# EAGLE design apex-iii-core (EAGLE 6.0)
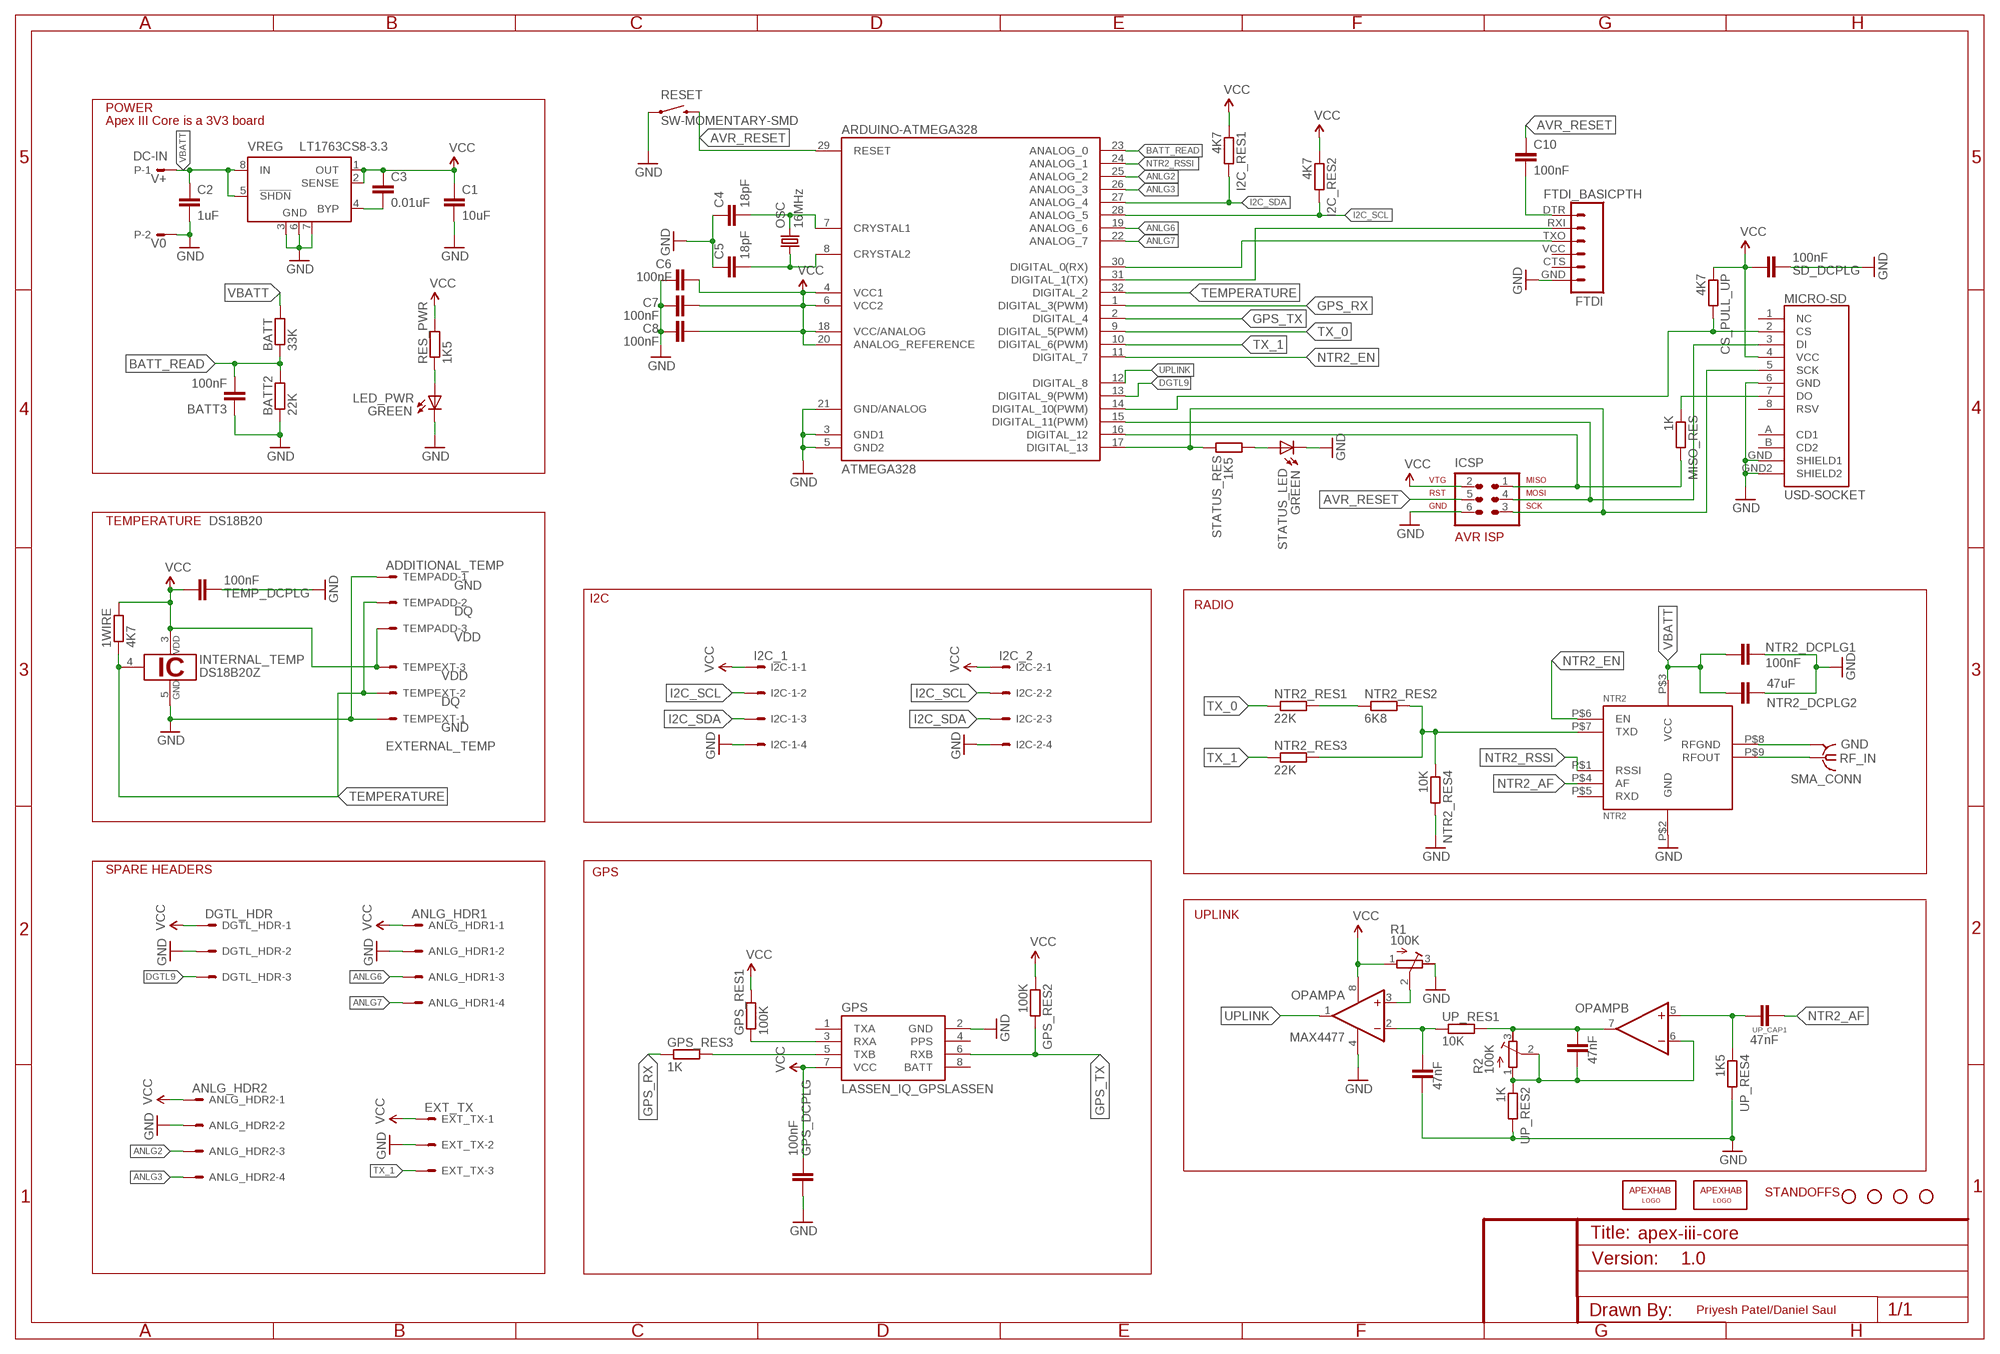
[diagram p0: schematic, sheet 1]

## Parts
1WIRE  4K7  R-EU_R0805  [R0805]
ANLG_HDR1  ANLG_HDR1  22-27-2041-04  [6410-04]
ANLG_HDR2  ANLG_HDR2  22-27-2041-04  [6410-04]
ARDUINO-ATMEGA328  ATMEGA328  ATMEGA168-AU  [TQFP32-08]
BATT  33K  R-EU_R0805  [R0805]
BATT2  22K  R-EU_R0805  [R0805]
BATT3  100nF  CAP0805  [0805]
C1  10uF  CAP0805  [0805]
C2  1uF  CAP0805  [0805]
C3  0.01uF  CAP0805  [0805]
C4  18pF  CAP0805  [0805]
C5  18pF  CAP0805  [0805]
C6  100nF  CAP0805  [0805]
C7  100nF  CAP0805  [0805]
C8  100nF  CAP0805  [0805]
C10  100nF  CAP0805  [0805]
CS_PULL_UP  4K7  R-EU_R0805  [R0805]
DGTL_HDR  DGTL_HDR  22-27-2031-03  [6410-03]
EXT_TX  EXT_TX  22-27-2031-03  [6410-03]
FTDI  FTDI_BASICPTH  [FTDI_BASIC]
GPS  LASSEN_IQ_GPSLASSEN  [LASSEN_IQ_GPS]
GPS_DCPLG  100nF  CAP0805  [0805]
GPS_RES1  100K  R-EU_R0805  [R0805]
GPS_RES2  100K  R-EU_R0805  [R0805]
GPS_RES3  1K  R-EU_R0805  [R0805]
I2C-1  I2C_1  22-27-2041-04  [6410-04]
I2C-2  I2C_2  22-27-2041-04  [6410-04]
I2C_RES1  4K7  R-EU_R0805  [R0805]
I2C_RES2  4K7  R-EU_R0805  [R0805]
ICSP  AVR-ISP-6  [AVR-ISP-6]
INTERNAL_TEMP  DS18B20Z  [SO08]
JP1  STAND-OFF  [STAND-OFF]
JP2  STAND-OFF  [STAND-OFF]
JP3  STAND-OFF  [STAND-OFF]
JP4  STAND-OFF  [STAND-OFF]
JP5  APEXHAB-LOGO_APEXHAB-SMALL  [APEXHAB-LOGO-SMALL]
JP6  APEXHAB-LOGO_APEXHAB  [APEXHAB-LOGO]
LED_PWR  GREEN  LEDCHIPLED_0603  [CHIPLED_0603]
MICRO-SD  USD-SOCKET  [MICRO-SD-PUSH-PULL]
MISO_RES  1K  R-EU_R0805  [R0805]
NTR2  NTR2  [NTR2]
NTR2_DCPLG1  100nF  CAP0805  [0805]
NTR2_DCPLG2  47uF  CAP0805  [0805]
NTR2_RES1  22K  R-EU_R0805  [R0805]
NTR2_RES2  6K8  R-EU_R0805  [R0805]
NTR2_RES3  22K  R-EU_R0805  [R0805]
NTR2_RES4  10K  R-EU_R0805  [R0805]
OPAMP  MAX4477  CA3240ED  [SO08]
OSC  16MHz  CRYSTAL5X3  [CRYSTAL-SMD-5X3]
P  DC-IN  22-27-2021-02  [6410-02]
R1  100K  R-TRIMM3214W  [RTRIM3214W]
R2  100K  R-TRIMM3214W  [RTRIM3214W]
RES_PWR  1K5  R-EU_R0805  [R0805]
RESET  SW-MOMENTARY-SMD  SWITCH-MOMENTARY-2-SMD-1101NE  [TACTILE-SWITCH-1101NE]
SD_DCPLG  100nF  CAP0805  [0805]
SMA_CONN  SMA-142-0701-801/806  [J502-ND-142-0701-801/806]
STATUS_LED  GREEN  LEDCHIPLED_0603  [CHIPLED_0603]
STATUS_RES  1K5  R-EU_R0805  [R0805]
TEMP_DCPLG  100nF  CAP0805  [0805]
TEMPADD  ADDITIONAL_TEMP  22-27-2031-03  [6410-03]
TEMPEXT  EXTERNAL_TEMP  22-27-2031-03  [6410-03]
UP_CAP1  47nF  CAP0805  [0805]
UP_CAP3  47nF  CAP0805  [0805]
UP_CAP4  47nF  CAP0805  [0805]
UP_RES1  10K  R-EU_R0805  [R0805]
UP_RES2  1K  R-EU_R0805  [R0805]
UP_RES4  1K5  R-EU_R0805  [R0805]
VREG  LT1763CS8-3.3  [SOIC8]

## Nets
ANLG2: ANLG_HDR2.3 ARDUINO-ATMEGA328.25(ANALOG_2)
ANLG3: ANLG_HDR2.4 ARDUINO-ATMEGA328.26(ANALOG_3)
ANLG6: ANLG_HDR1.3 ARDUINO-ATMEGA328.19(ANALOG_6)
ANLG7: ANLG_HDR1.4 ARDUINO-ATMEGA328.22(ANALOG_7)
AVR_RESET: ARDUINO-ATMEGA328.29(RESET) C10.1 ICSP.5 RESET.P$2
BATT_READ: ARDUINO-ATMEGA328.23(ANALOG_0) BATT2.2 BATT3.2 BATT.1
DGTL9: ARDUINO-ATMEGA328.13(DIGITAL_9(PWM)) DGTL_HDR.3
GND: ANLG_HDR1.2 ANLG_HDR2.2 ARDUINO-ATMEGA328.3(GND1) ARDUINO-ATMEGA328.5(GND2) ARDUINO-ATMEGA328.21(GND/ANALOG) BATT2.1 BATT3.1 C1.2 C2.2 C4.1 C5.1 C6.1 C7.1 C8.1 DGTL_HDR.2 EXT_TX.2 FTDI.GND GPS.2(GND) GPS_DCPLG.2 I2C-1.4 I2C-2.4 ICSP.6 INTERNAL_TEMP.5 LED_PWR.C MICRO-SD.6(GND) MICRO-SD.GND2(SHIELD2) MICRO-SD.GND(SHIELD1) NTR2.P$2(GND) NTR2.P$8(RFGND) NTR2_DCPLG1.1 NTR2_DCPLG2.1 NTR2_RES4.2 OPAMP.4(P:V-) P.2 R1.3(A) RESET.P$1 SD_DCPLG.1 SMA_CONN.G@1(GND) STATUS_LED.C TEMP_DCPLG.1 TEMPADD.1 TEMPEXT.1 UP_CAP4.2 UP_RES2.2 UP_RES4.2 VREG.3(GND) VREG.6(GND) VREG.7(GND)
GPS_RX: ARDUINO-ATMEGA328.1(DIGITAL_3(PWM)) GPS_RES3.1
GPS_TX: ARDUINO-ATMEGA328.2(DIGITAL_4) GPS.6(RXB) GPS_RES2.2
I2C_SCL: ARDUINO-ATMEGA328.28(ANALOG_5) I2C-1.2 I2C-2.2 I2C_RES2.2
I2C_SDA: ARDUINO-ATMEGA328.27(ANALOG_4) I2C-1.3 I2C-2.3 I2C_RES1.2
MISO: ARDUINO-ATMEGA328.16(DIGITAL_12) ICSP.1 MISO_RES.2
MOSI: ARDUINO-ATMEGA328.15(DIGITAL_11(PWM)) ICSP.4 MICRO-SD.3(DI)
N$1: C3.2 VREG.4(BYP)
N$2: MICRO-SD.7(DO) MISO_RES.1
N$3: LED_PWR.A RES_PWR.1
N$4: C10.2 FTDI.DTR
N$5: ARDUINO-ATMEGA328.8(CRYSTAL2) C5.2 OSC.1
N$6: ARDUINO-ATMEGA328.7(CRYSTAL1) C4.2 OSC.3
N$8: STATUS_LED.A STATUS_RES.2
N$9: ARDUINO-ATMEGA328.31(DIGITAL_1(TX)) FTDI.RXI
N$10: ARDUINO-ATMEGA328.30(DIGITAL_0(RX)) FTDI.TXO
N$11: ARDUINO-ATMEGA328.14(DIGITAL_10(PWM)) CS_PULL_UP.2 MICRO-SD.2(CS)
N$12: NTR2.P$7(TXD) NTR2_RES2.2 NTR2_RES3.2 NTR2_RES4.1
N$13: GPS.3(RXA) GPS_RES1.1
N$14: GPS.5(TXB) GPS_RES3.2
N$15: OPAMP.3(A:+IN) R1.2(S)
N$16: NTR2_RES1.2 NTR2_RES2.1
N$20: OPAMP.5(B:+IN) UP_CAP1.2 UP_RES4.1
N$22: OPAMP.7(B:OUT) R2.3(A) UP_CAP3.1 UP_RES1.2
N$23: OPAMP.6(B:-IN) R2.1(E) R2.2(S) UP_CAP3.2 UP_RES2.1
NTR2_AF: NTR2.P$4(AF) UP_CAP1.1
NTR2_EN: ARDUINO-ATMEGA328.11(DIGITAL_7) NTR2.P$6(EN)
NTR2_RSSI: ARDUINO-ATMEGA328.24(ANALOG_1) NTR2.P$1(RSSI)
RANDOM: OPAMP.2(A:-IN) UP_CAP4.1 UP_RES1.1
RF_IN: NTR2.P$9(RFOUT) SMA_CONN.1
SCK: ARDUINO-ATMEGA328.17(DIGITAL_13) ICSP.3 MICRO-SD.5(SCK) STATUS_RES.1
TEMPERATURE: 1WIRE.1 ARDUINO-ATMEGA328.32(DIGITAL_2) INTERNAL_TEMP.4 TEMPADD.2 TEMPEXT.2
TX_0: ARDUINO-ATMEGA328.9(DIGITAL_5(PWM)) NTR2_RES1.1
TX_1: ARDUINO-ATMEGA328.10(DIGITAL_6(PWM)) EXT_TX.3 NTR2_RES3.1
UPLINK: ARDUINO-ATMEGA328.12(DIGITAL_8) OPAMP.1(A:OUT)
VBATT: BATT.2 C2.1 NTR2.P$3(VCC) NTR2_DCPLG1.2 NTR2_DCPLG2.2 P.1 VREG.5(!SHDN) VREG.8(IN)
VCC: 1WIRE.2 ANLG_HDR1.1 ANLG_HDR2.1 ARDUINO-ATMEGA328.4(VCC1) ARDUINO-ATMEGA328.6(VCC2) ARDUINO-ATMEGA328.18(VCC/ANALOG) ARDUINO-ATMEGA328.20(ANALOG_REFERENCE) C1.1 C3.1 C6.2 C7.2 C8.2 CS_PULL_UP.1 DGTL_HDR.1 EXT_TX.1 GPS.7(VCC) GPS_DCPLG.1 GPS_RES1.2 GPS_RES2.1 I2C-1.1 I2C-2.1 I2C_RES1.1 I2C_RES2.1 ICSP.2 INTERNAL_TEMP.3 MICRO-SD.4(VCC) OPAMP.8(P:V+) R1.1(E) RES_PWR.2 SD_DCPLG.2 TEMP_DCPLG.2 TEMPADD.3 TEMPEXT.3 VREG.1(OUT) VREG.2(SENSE)
Unconnected: FTDI.CTS FTDI.VCC GPS.1(TXA) GPS.4(PPS) MICRO-SD.1(NC) MICRO-SD.8(RSV) MICRO-SD.A(CD1) MICRO-SD.B(CD2) NTR2.P$5(RXD)

## Notes on the sheet
- POWER
- Apex III Core is a 3V3 board
- V+
- V0
- TEMPERATURE | DS18B20
- GND
- I2C
- RADIO
- DQ
- VDD
- VDD
- DQ
- GND
- SPARE HEADERS | GPS
- UPLINK
- STANDOFFS
- 1.0
- Priyesh Patel/Daniel Saul

## Power pins joined to a net without a drawn wire
BATT: GPS.8(BATT)
GND: SMA_CONN.G@2(GND) SMA_CONN.G@3(GND) SMA_CONN.G@4(GND)

## Library data of the parts
1WIRE BATT BATT2 CS_PULL_UP GPS_RES1-GPS_RES3 I2C_RES1 I2C_RES2 MISO_RES NTR2_RES1-NTR2_RES4 RES_PWR STATUS_RES UP_RES1 UP_RES2 UP_RES4 = apex:R-EU_: RESISTOR, European symbol
ANLG_HDR1 ANLG_HDR2 I2C-1 I2C-2 = apex:22-?-04: CONNECTOR wire to board 2.54 mm (.1 inch) pitch header; OC_FARNELL: unknown; OC_NEWARK: unknown
ARDUINO-ATMEGA328 = Arduino-AVR:ATMEGA168
BATT3 C1-C8 C10 GPS_DCPLG NTR2_DCPLG1 NTR2_DCPLG2 SD_DCPLG TEMP_DCPLG UP_CAP1 UP_CAP3 UP_CAP4 = SparkFun:CAP: Capacitor Standard 0603 ceramic capacitor, and 0.1" leaded capacitor.
DGTL_HDR EXT_TX = apex:22-?-03: CONNECTOR wire to board 2.54 mm (.1 inch) pitch header; OC_FARNELL: unknown; OC_NEWARK: unknown
FTDI = SparkFun:FTDI_BASIC: FTDI Basic: 3.3V and 5V
GPS = SparkFun:LASSEN_IQ_GPS: Lassen iq 12-Channel GPS receiver. Schematic and footprint production proven. Spark Fun Electronics SKU : GPS-00163. Surface mount mating connector : GPS-00170
ICSP = avr-4:AVR-ISP-6: AVR ISP-6 Serial Programming Header
INTERNAL_TEMP = 1wire:DS18B20: Programmable Resolution Digital Thermometer This chip provides a onewire thermosensor with approx. 0.5°C accuracy. A programmable over/undertemperure alarm is available. The precision can be set from 9..12 bits. Notes: Vdd must be applied for accurate measurements at low temperatures, as the parasite power circuit otherwise heats the sensor. If parasite power is used, Vdd has to be connected to GND. The DS1822 is a low-cost thermometer chip, the DS18S20 is similar to the DS18B20, but with 9 Bit precision only. Author: Jan Kandziora <jjj@gmx.de>
JP1-JP4 = SparkFun:STAND-OFF: Stand Off This is the mechanical footprint for a #4 phillips button head screw. Use the keepout ring to avoid running the screw head into surrounding components. SKU : PRT-00447
JP5 JP6 = apex:APEXHAB-LOGO: ApexHAB PCB Logo This is the standard ApexHAB PCB logo.
LED_PWR STATUS_LED = led:LED: LED OSRAM: - CHIPLED LG R971, LG N971, LY N971, LG Q971, LY Q971, LO R971, LY R971 LH N974, LH R974 LS Q976, LO Q976, LY Q976 LO Q996 - Hyper CHIPLED LW Q18S LB Q993, LB Q99A, LB R99A - SideLED LS A670, LO A670, LY A670, LG A670, LP A670 LB A673, LV A673, LT A673, LW A673 LH A674 LY A675 LS A676, LA A676, LO A676, LY A676, LW A676 LS A679, LY A679, LG A679 - Hyper Micro SIDELED® LS Y876, LA Y876, LO Y876, LY Y876 LT Y87S - SmartLED LW L88C, LW L88S LB L89C, LB L89S, LG L890 LS L89K, LO L89K, LY L89K LS L896, LA L896, LO L896, LY L896 - TOPLED LS T670, LO T670, LY T670, LG T670, LP T670 LSG T670, LSP T670, LSY T670, LOP T670, LYG T670 LG T671, LOG T671, LSG T671 LB T673, LV T673, LT T673, LW T673 LH T674 LS T676, LA T676, LO T676, LY T676, LB T676, LH T676, LSB T676, LW T676 LB T67C, LV T67C, LT T67C, LS T67K, LO T67K, LY T67K, LW E67C LS E67B, LA E67B, LO E67B, LY E67B, LB E67C, LV E67C, LT E67C LW T67C LS T679, LY T679, LG T679 LS T770, LO T770, LY T770, LG T770, LP T770 LB T773, LV T773, LT T773, LW T773 LH T774 LS E675, LA E675, LY E675, LS T675 LS T776, LA T776, LO T776, LY T776, LB T776 LHGB T686 LT T68C, LB T68C - Hyper Mini TOPLED® LB M676 - Mini TOPLED Santana® LG M470 LS M47K, LO M47K, LY M47K Source: http://www.osram.convergy.de LUXEON: - LUMILED® LXK2-PW12-R00, LXK2-PW12-S00, LXK2-PW14-U00, LXK2-PW14-V00 LXK2-PM12-R00, LXK2-PM12-S00, LXK2-PM14-U00 LXK2-PE12-Q00, LXK2-PE12-R00, LXK2-PE12-S00, LXK2-PE14-T00, LXK2-PE14-U00 LXK2-PB12-K00, LXK2-PB12-L00, LXK2-PB12-M00, LXK2-PB14-N00, LXK2-PB14-P00, LXK2-PB14-Q00 LXK2-PR12-L00, LXK2-PR12-M00, LXK2-PR14-Q00, LXK2-PR14-R00 LXK2-PD12-Q00, LXK2-PD12-R00, LXK2-PD12-S00 LXK2-PH12-R00, LXK2-PH12-S00 LXK2-PL12-P00, LXK2-PL12-Q00, LXK2-PL12-R00 Source: www.luxeon.com KINGBRIGHT: KA-3528ASYC Source: www.kingbright.com
MICRO-SD = matt_brejza:USD-SOCKET: microSD Socket Push-push type uSD socket. Schematic element and footprint production proven. Spark Fun Electronics SKU : PRT-00127. tDoc lines correctly indicate media card edge positions when inserting (unlocked, locked, depressed).
NTR2 = apex:NTR2
OPAMP = linear:CA3240E: OP AMP
OSC = SparkFun:CRYSTAL: Crystals Various standard crystals. Proven footprints. Spark Fun Electronics SKU : COM-00534
P = con-molex:22-?-02: CONNECTOR wire to board 2.54 mm (.1 inch) pitch header; OC_FARNELL: unknown; OC_NEWARK: unknown
R1 R2 = resistor:R-TRIMM: Trimm resistor
RESET = SparkFun:SWITCH-MOMENTARY-2
SMA_CONN = con-coax:SMA-: SMA 50 Ohm End Launch Jack Receptacle - Round Contact Johnson Components Source: www.johnsoncomponents.com .. J502-ND.pdf; MF: JOHNSON COMPONENTS; MPN: 142-0701-801; OC_FARNELL: 1608592; OC_NEWARK: 90F2624
TEMPADD TEMPEXT = con-molex:22-?-03: CONNECTOR wire to board 2.54 mm (.1 inch) pitch header; OC_FARNELL: unknown; OC_NEWARK: unknown
VREG = linear-technology:LT1763CS8: 500mA, Low Noise, LDO Micropower Regulators Source: http://cds.linear.com/docs/Datasheet/1763ff.pdf; MPN: LT1763CS8-3.3; OC_FARNELL: 1273617; OC_NEWARK: 57M6055

## Board
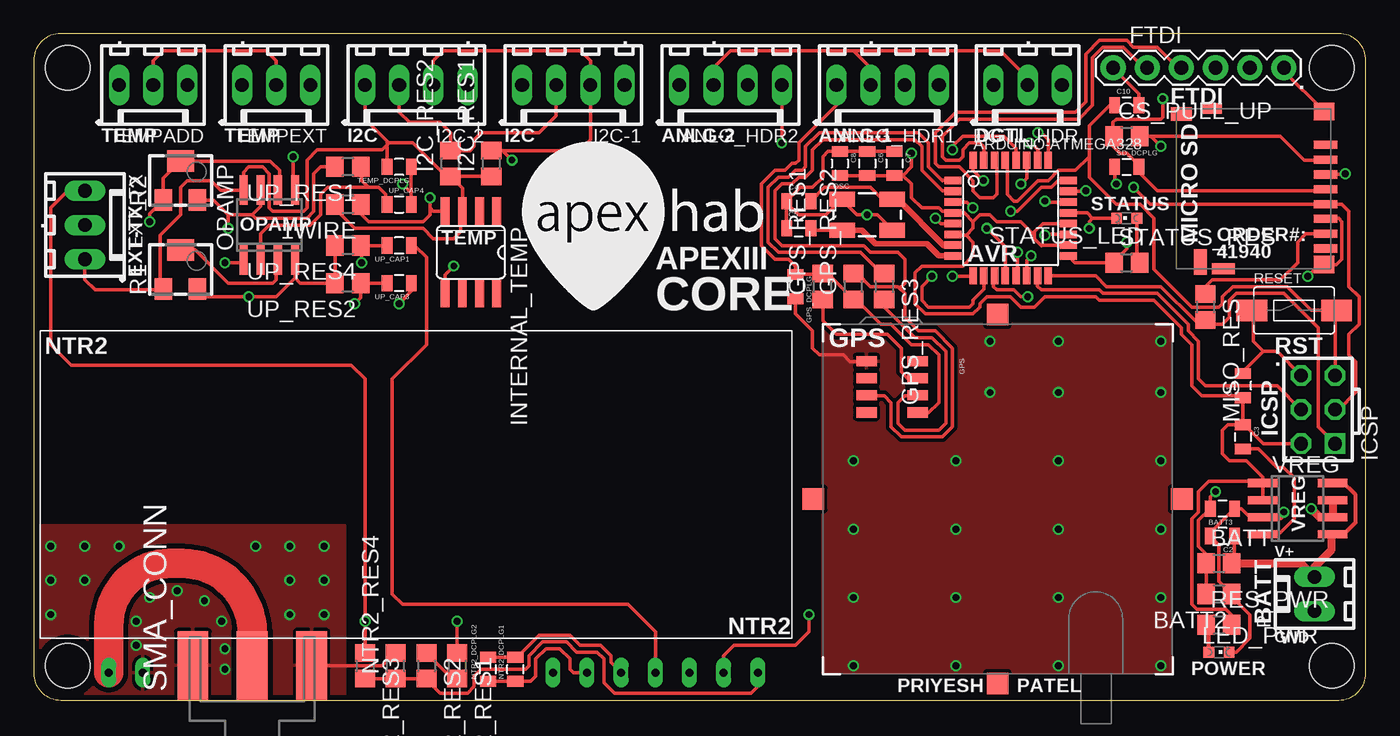
[diagram p1: board, top side]
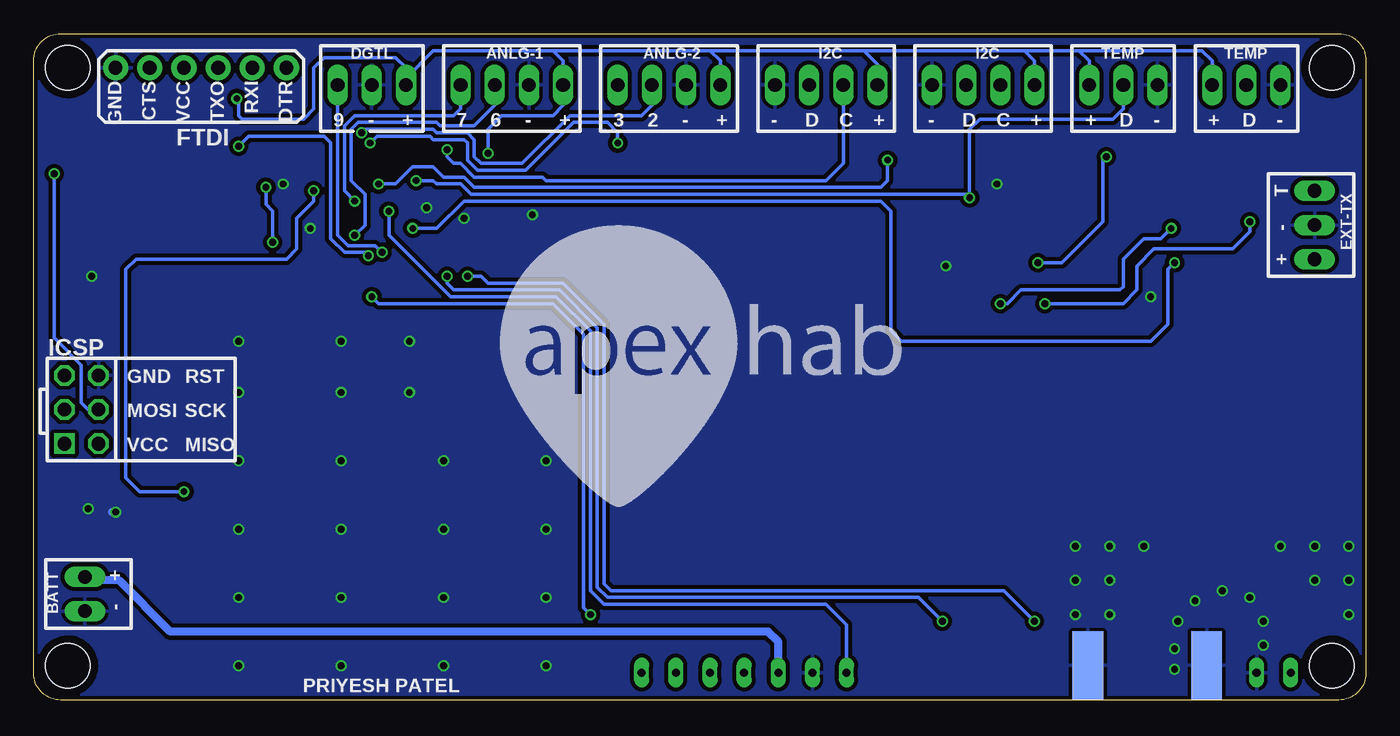
[diagram p2: board, bottom side, seen from below]

Size 99.06 x 49.53 mm. Coordinates in mm from the lower left corner, seen from the top.
Outline: 0,47.53 0,2 arc90 2,0 97.06,0 arc90 99.06,2 99.06,47.53 arc90 97.06,49.53 2,49.53 arc90 0,47.53
Copper layers (1*16): Top 0.035mm / dielectric 1.5mm / Bottom 0.035mm
Design rules: minimum track width 6mil, minimum drill 12mil, track to track 6mil, track to pad 6mil, pad to pad 6mil, via to via 6mil, smd to smd 0mil, copper to edge 10mil, drill to drill 10mil, minimum pad ring 10mil, minimum via ring 6mil, stop-mask expansion 2mil, vias tented up to drill 100mil, thermal gap 10mil

### Footprints (pad centres in the part's own frame; a part is rotated, then mirrored left to right if it is on the bottom)
R0805 = smd 1.3 x 1.5: 1 -0.95,0; 2 0.95,0
6410-04 = drill 1.016 long: 1 3.81,0; 2 1.27,0; 3 -1.27,0; 4 -3.81,0
TQFP32-08 = smd 1.27 x 0.559: 1 -4.293,2.8; 2 -4.293,2; 3 -4.293,1.2; 4 -4.293,0.4; 5 -4.293,-0.4; 6 -4.293,-1.2; 7 -4.293,-2; 8 -4.293,-2.8; 17 4.293,-2.8; 18 4.293,-2; 19 4.293,-1.2; 20 4.293,-0.4; 21 4.293,0.4; 22 4.293,1.2; 23 4.293,2; 24 4.293,2.8 | smd 0.559 x 1.27: 9 -2.8,-4.293; 10 -2,-4.293; 11 -1.2,-4.293; 12 -0.4,-4.293; 13 0.4,-4.293; 14 1.2,-4.293; 15 2,-4.293; 16 2.8,-4.293; 25 2.8,4.293; 26 2,4.293; 27 1.2,4.293; 28 0.4,4.293; 29 -0.4,4.293; 30 -1.2,4.293; 31 -2,4.293; 32 -2.8,4.293
0805 = smd 0.8 x 1.2: 1 -0.9,0; 2 0.9,0
6410-03 = drill 1.016 long: 1 2.54,0; 2 0,0; 3 -2.54,0
FTDI_BASIC = drill 1.016 pad 1.88: CTS 10.16,0; DTR 0,0; GND 12.7,0; RXI 2.54,0; TXO 5.08,0; VCC 7.62,0
LASSEN_IQ_GPS = smd 0.762 x 1.524: 1 2.752,7.076; 2 2.752,3.266; 3 4.022,7.076; 4 4.022,3.266; 5 5.292,7.076; 6 5.292,3.266; 7 6.562,7.076; 8 6.562,3.266 | smd 1.6 x 1.6: GND1 -0.7,13; GND2 13,26.7; GND3 26.7,13; GND4 13,-0.7
AVR-ISP-6 = drill 1.016 square: 1 -2.54,-1.27 | drill 1.016 octagon: 2 -2.54,1.27; 3 0,-1.27; 4 0,1.27; 5 2.54,-1.27; 6 2.54,1.27
SO08 = smd 0.66 x 2.032: 1 -1.905,-3.073; 2 -0.635,-3.073; 3 0.635,-3.073; 4 1.905,-3.073; 5 1.905,3.073; 6 0.635,3.073; 7 -0.635,3.073; 8 -1.905,3.073
STAND-OFF = hole 3.302: 0,0
CHIPLED_0603 = smd 0.8 x 0.8: A 0,-0.75; C 0,0.75
MICRO-SD-PUSH-PULL = smd 0.6 x 1.75: 1 5.7,-0.8; 2 4.6,-0.8; 3 3.5,-0.8; 4 2.4,-0.8; 5 1.3,-0.8; 6 0.2,-0.8; 7 -0.9,-0.8; 8 -2,-0.8 | smd 1 x 1.55: A 8,9.9 | smd 1.9 x 1: B -3,8.5 | smd 1.3 x 1.5: GND 8.2,-0.7; GND2 -3.2,-0.7 | smd 0.8 x 1.4: GND1 8.4,7.6 | smd 0.8 x 1.7: GND3 -3.5,6.8
NTR2 = drill 0.6 long: P$1 0,0; P$2 2.54,0; P$3 5.08,0; P$4 7.62,0; P$5 10.16,0; P$6 12.7,0; P$7 15.24,0; P$8 -30.48,0; P$9 -33.02,0
SO08' = smd 0.6 x 2.2: 1 -1.905,-2.6; 2 -0.635,-2.6; 3 0.635,-2.6; 4 1.905,-2.6; 5 1.905,2.6; 6 0.635,2.6; 7 -0.635,2.6; 8 -1.905,2.6
CRYSTAL-SMD-5X3 = smd 1.9 x 1.1: 1 -1.85,-1.15; 2 1.85,-1.15; 3 1.85,1.15; 4 -1.85,1.15
6410-02 = drill 1.016 long: 1 1.27,0; 2 -1.27,0
RTRIM3214W = smd 1.3 x 1.6: 1 -1.275,-1.45; 3 1.275,-1.45 | smd 2 x 1.6: 2 0,1.45
TACTILE-SWITCH-1101NE = smd 2.3 x 1.6: P$1 -3.15,0; P$2 3.15,0
J502-ND-142-0701-801/806 = smd 5.08 x 2.286: 1 2.565,0; G@1 2.565,4.42; G@2 2.565,-4.42 | smd 5.08 x 2.286 bottom: G@3 2.565,4.42; G@4 2.565,-4.42
SOIC8 = smd 0.6 x 2.2: 1 -1.905,-2.6; 2 -0.635,-2.6; 3 0.635,-2.6; 4 1.905,-2.6; 5 1.905,2.6; 6 0.635,2.6; 7 -0.635,2.6; 8 -1.905,2.6

### Placement (x,y rotation side)
1WIRE  23.37,36.83 180 top
ANLG_HDR1  63.5,45.72 180 top
ANLG_HDR2  51.82,45.72 180 top
ARDUINO-ATMEGA328  72.64,35.81 0 top
BATT  88.14,10.16 0 top
BATT2  88.14,7.87 180 top
BATT3  88.39,14.22 180 top
C1  89.92,23.37 90 top
C2  88.39,12.19 180 top
C3  89.92,19.56 270 top
C4  56.9,37.08 0 top
C5  56.9,35.05 0 top
C6  61.98,39.88 270 top
C7  64.01,39.88 270 top
C8  59.94,39.88 270 top
C10  81.28,44.2 0 top
CS_PULL_UP  81.28,41.91 0 top
DGTL_HDR  73.91,45.72 180 top
EXT_TX  3.81,35.31 270 top
FTDI  80.26,46.99 0 top
GPS  58.67,27.94 270 top
GPS_DCPLG  56.64,30.73 270 top
GPS_RES1  58.67,30.73 90 top
GPS_RES2  60.96,30.73 90 top
GPS_RES3  63.25,30.73 270 top
I2C-1  40.13,45.72 180 top
I2C-2  28.45,45.72 180 top
I2C_RES1  34.04,39.88 90 top
I2C_RES2  30.99,39.88 90 top
ICSP  95.5,21.59 90 top
INTERNAL_TEMP  32.51,33.27 180 top
JP1  2.54,46.99 0 top
JP2  96.52,46.99 0 top
JP3  96.52,2.54 0 top
JP4  2.54,2.54 0 top
JP5  36.32,28.96 0 top
JP6  64.39,14.35 0 bottom
LED_PWR  88.14,3.56 270 top
MICRO-SD  95.25,35.56 90 top
MISO_RES  87.12,29.21 270 top
NTR2  38.61,2.03 0 top
NTR2_DCPLG1  35.81,2.29 90 top
NTR2_DCPLG2  33.78,2.29 90 top
NTR2_RES1  31.5,2.54 270 top
NTR2_RES2  29.21,2.54 270 top
NTR2_RES3  24.64,2.54 270 top
NTR2_RES4  26.92,2.54 90 top
OPAMP  MAX4477  [SO08']  17.53,35.31 0 top
OSC  61.98,36.07 0 top
P  95.25,7.87 90 top
R1  10.92,32 0 top
R2  10.92,38.61 0 top
RES_PWR  88.14,5.59 0 top
RESET  93.73,28.96 0 top
SD_DCPLG  81.28,39.62 0 top
SMA_CONN  16.26,0 90 top
STATUS_LED  81.28,35.81 90 top
STATUS_RES  81.28,32.51 0 top
TEMP_DCPLG  27.18,39.62 180 top
TEMPADD  8.89,45.72 180 top
TEMPEXT  18.03,45.72 180 top
UP_CAP1  27.18,33.78 180 top
UP_CAP3  27.18,30.99 180 top
UP_CAP4  27.18,36.83 0 top
UP_RES1  23.37,39.62 180 top
UP_RES2  23.37,30.99 180 top
UP_RES4  23.37,33.78 180 top
VREG  93.98,14.22 270 top

### Tracks (layer width: path | path; a pad name or v marks a point on that pad's centre or on a via)
ANLG2  (via drill 0.51)
  Top 0.254: v74.68,42.16 74.93,42.16 75.44,41.65 ARDUINO-ATMEGA328.25
  Bottom 0.254: ANLG_HDR2.3 53.09,44.2 53.85,43.43 59.18,43.43 62.74,39.88 65.79,39.88 66.29,40.39 66.29,41.66 66.8,42.16 69.09,42.16 69.34,42.42 74.42,42.42 v74.68,42.16
ANLG3  (via drill 0.51)
  Top 0.254: v74.04,41.4 74.17,41.4 74.68,40.89 74.68,40.14 ARDUINO-ATMEGA328.26 | ANLG_HDR2.4 v55.63,41.4
  Bottom 0.254: v74.04,41.4 73.53,41.91 69.6,41.91 69.34,41.66 67.06,41.66 66.8,41.4 66.8,40.13 66.04,39.37 62.48,39.37 58.93,42.93 56.39,42.93 55.63,42.16 v55.63,41.4
ANLG6  (via drill 0.51)
  Top 0.254: ARDUINO-ATMEGA328.19 75.25,34.61 v75.18,34.54
  Bottom 0.254: v75.18,34.54 74.42,35.31 74.42,37.59 75.44,38.61 75.44,42.42 74.93,42.93 69.09,42.93 68.83,42.67 66.29,42.67 64.77,44.2 ANLG_HDR1.3
ANLG7  (via drill 0.51)
  Top 0.254: ARDUINO-ATMEGA328.22 75.25,37.01 v75.18,37.08
  Bottom 0.254: v75.18,37.08 75.95,37.85 75.95,42.67 75.18,43.43 67.82,43.43 67.31,43.94 ANLG_HDR1.4
AVR_RESET
  Top 0.254: ICSP.5 96.77,28.85 RESET.P$2 95,28.96 93.22,30.73 89.15,30.73 88.39,29.97 88.39,29.46 88.14,29.21 86.11,29.21 83.31,32 83.31,35.81 82.3,36.83 80.52,36.83 78.49,38.86 78.49,40.39 | C10.1 80.01,44.2 78.49,42.67 78.49,40.39 | ARDUINO-ATMEGA328.29 72.39,39.96 72.39,37.59 72.9,37.08 73.15,37.08 74.68,38.61 75.44,38.61 76.2,39.37 77.47,39.37 78.49,40.39
BATT_READ  (via drill 0.51)
  Top 0.254: BATT2.2 BATT.1 87.12,10.16 87.12,10.92 86.61,11.43 86.61,13.35 BATT3.2 87.49,15.1 v87.88,15.49 | ARDUINO-ATMEGA328.23 78.2,37.81 v78.23,37.85
  Bottom 0.254: v87.88,15.49 91.19,15.49 92.2,16.51 92.2,32 91.44,32.77 80.26,32.77 79.5,33.53 79.5,35.81 78.23,37.08 v78.23,37.85
DGTL9  (via drill 0.51)
  Top 0.254: v73.15,33.27 73.15,31.63 ARDUINO-ATMEGA328.13
  Bottom 0.254: DGTL_HDR.3 76.45,34.54 75.69,33.78 73.66,33.78 v73.15,33.27
GND  (via drill 0.51)
  Top 0.254: 89.04,7.92 BATT2.1 | 63.75,34.8 63.75,35.05 62.74,36.07 v61.98,36.07 61.21,36.07 60.07,37.21 58.93,36.07 56.9,36.07 56,36.97 C4.1 | C4.1 C5.1 | ARDUINO-ATMEGA328.5 67.46,35.41 v67.06,35.81 | ARDUINO-ATMEGA328.3 69.41,37.01 v69.85,36.58 | 76.83,36.32 ARDUINO-ATMEGA328.21 78.34,36.21 78.74,35.81 | NTR2_DCPLG2.1 NTR2_DCPLG1.1 36.95,1.39 37.34,1.78 37.34,3.05 38.1,3.81 39.12,3.81 39.88,3.05 39.88,2.29 40.13,2.03 NTR2.P$2 | VREG.3 90.44,13.59 89.8,14.22 BATT3.1 87.49,12.42 C2.2 | BATT2.1 89.09,7.69 90.42,6.35 90.42,4.57 89.41,3.56 LED_PWR.C | C2.2 87.24,11.82 | BATT2.1 88.14,8.82 88.14,11.55 C2.2 | C2.2 87.24,12.42 | 94.23,24.27 ICSP.6 92.46,25.91 91.44,25.91 | FTDI.GND 92.96,46.75 MICRO-SD.GND | NTR2_RES4.2 26.86,3.49 25.91,2.54 20.7,2.54 SMA_CONN.G@4 | GPS_DCPLG.2 56.64,28.7 57.91,27.43 57.91,26.16 58.42,25.65 60.2,25.65 60.71,25.15 61.9,25.15 GPS.2 | 91.44,25.91 90.68,26.67 90.68,28.85 RESET.P$1 | 64.12,40.78 C7.1 C6.1 C8.1 59.07,40.78 58.67,40.39 58.67,38.86 57.91,38.1 57.01,38.1 C4.1 | MICRO-SD.6 96.1,35.81 97.03,35.81 97.28,35.56 97.28,32.77 96.88,32.36 MICRO-SD.GND2 95.61,32.36 v94.74,31.5 | SD_DCPLG.1 80.38,38.75 80.52,38.61 v80.52,38.35 | v78.49,35.05 78.49,35.56 78.74,35.81 | ANLG_HDR1.2 62.23,46.99 60.96,48.26 | 60.96,48.26 51.82,48.26 50.55,46.99 ANLG_HDR2.2 | DGTL_HDR.2 73.91,46.23 71.88,48.26 60.96,48.26 | OPAMP.4 19.43,31.37 | 19.43,31.37 18.03,29.97 v16,29.97 12.7,29.97 12.2,30.48 R1.3 | 19.43,31.37 19.81,30.99 UP_RES2.2 UP_RES4.2 | TEMP_DCPLG.1 UP_CAP4.2 28.08,37.71 v27.43,38.35 | STATUS_LED.C 78.74,35.81 | INTERNAL_TEMP.5 30.61,31.62 v31.24,32.26 | C1.2 89.92,24.38 91.44,25.91
  Top 0.61: VREG.7 VREG.6 95.63,13.59 v95,14.22 | VREG.3 92.58,13.59 v92.96,13.97
  Bottom 0.61: v92.96,13.97 93.22,13.97
  other vias: 60.96,17.78 68.58,17.78 71.12,22.86 76.2,22.86 83.82,22.86 83.82,17.78 76.2,17.78 60.96,12.7 68.58,12.7 76.2,12.7 83.82,12.7 83.82,7.62 76.2,7.62 76.2,2.54 83.82,2.54 68.58,7.62 68.58,2.54 60.96,2.54 60.96,7.62 71.12,26.67 76.2,26.67 83.82,26.67 1.27,11.43 3.81,11.43 6.35,11.43 1.27,8.89 3.81,8.89 1.27,6.35 7.62,5.84 7.62,4.06 8.64,7.62 10.67,8.13 12.7,7.37 13.97,5.84 14.22,3.81 14.22,2.29 21.59,6.35 19.05,6.35 19.05,8.89 21.59,8.89 21.59,11.43 19.05,11.43 16.51,11.43
  pour Bottom (isolate 0.305): 0,49.53 99.06,49.53 99.06,0 0,0
  pour Top (isolate 0.254): 58.67,27.94 58.67,2.03 84.58,2.03 84.58,27.94
  pour Top (isolate 0.381): 0,0 0,12.95 23.11,12.95 23.11,0
GPS_RX
  Top 0.254: GPS_RES3.1 63.06,31.68 61.47,33.27 55.37,33.27 54.61,34.04 54.61,38.1 55.37,38.86 56.13,38.86 56.64,39.37 57.15,39.37 57.4,39.62 57.4,41.15 58.42,42.16 65.79,42.16 66.55,41.4 66.55,39.62 67.56,38.61 67.57,38.61 ARDUINO-ATMEGA328.1
GPS_TX
  Top 0.254: GPS_RES2.2 61.28,31.68 62.23,30.73 64.26,30.73 64.39,30.61 | 64.39,30.61 64.77,30.23 64.77,28.45 65.79,27.43 67.06,27.43 68.33,26.16 68.33,20.32 67.56,19.56 64.52,19.56 63.75,20.32 63.75,22.1 63.25,22.61 61.98,22.61 GPS.6 | 64.39,30.61 64.77,30.99 64.77,32.77 64.26,33.27 62.23,33.27 61.72,33.78 55.63,33.78 55.12,34.29 55.12,37.85 55.63,38.35 56.39,38.35 56.9,38.86 57.4,38.86 57.91,39.37 57.91,40.89 58.67,41.66 65.53,41.66 66.04,41.15 66.04,39.37 67.56,37.85 68.32,37.85 ARDUINO-ATMEGA328.2
I2C_SCL  (via drill 0.51)
  Top 0.254: I2C-1.2 38.86,43.43 37.59,42.16 33.27,42.16 32.77,41.66 32.77,41.15 32.45,40.83 I2C_RES2.2 30.99,42.16 30.23,42.93 27.94,42.93 27.18,43.69 I2C-2.2 | ARDUINO-ATMEGA328.28 73.04,41 72.14,41.91 69.09,41.91 68.33,41.15 v68.33,40.89
  Bottom 0.254: I2C-1.2 38.86,39.88 40.13,38.61 60.96,38.61 61.21,38.86 66.29,38.86 67.31,39.88 67.82,39.88 68.33,40.39 v68.33,40.89
I2C_SDA  (via drill 0.51)
  Top 0.254: I2C-2.3 29.72,47.5 30.48,48.26 40.64,48.26 41.4,47.5 I2C-1.3 41.4,41.66 40.57,40.83 I2C_RES1.2 34.86,40.83 v35.56,40.13 | ARDUINO-ATMEGA328.27 73.84,38.79 v73.41,38.35
  Bottom 0.254: v73.41,38.35 72.14,38.35 70.87,39.62 69.34,39.62 68.58,38.86 67.06,38.86 66.29,38.1 36.07,38.1 35.56,38.61 v35.56,40.13
MISO
  Top 0.254: ARDUINO-ATMEGA328.16 78.97,31.52 79.76,30.73 83.82,30.73 86.36,28.19 87.06,28.19 MISO_RES.2 | ICSP.1 95.5,20.32 95.5,27.69 92.96,30.23 89.41,30.23 88.9,29.72 88.9,28.45 88.39,27.94 87.44,27.94 MISO_RES.2 | 87.44,28.19 MISO_RES.2
MOSI  (via drill 0.51)
  Top 0.254: ARDUINO-ATMEGA328.15 74.64,30.77 74.93,30.48 79.25,30.48 79.5,30.23 83.57,30.23 85.85,27.94 85.85,27.43 86.61,26.67 86.61,23.88 87.12,23.37 92.46,23.37 ICSP.4 | MICRO-SD.3 97.48,39.06 v97.54,39.12
  Bottom 0.254: v97.54,39.12 97.54,26.92 95.5,24.89 95.5,22.1 95,21.59 ICSP.4
N$1
  Top 0.254: VREG.4 91.51,12.45 92.71,12.45 93.73,13.46 93.73,16.51 92.96,17.27 92.46,17.27 91.07,18.66 C3.2
N$2
  Top 0.254: MICRO-SD.7 94.6,34.66 93.98,34.04 93.98,32.51 92.71,31.24 87.63,31.24 87.12,30.73 MISO_RES.1
N$3
  Top 0.305: LED_PWR.A 87.39,5.39 RES_PWR.1
N$4
  Top 0.254: C10.2 82.18,45.07 FTDI.DTR
N$5
  Top 0.254: OSC.1 57.93,34.92 C5.2
  Top 0.406: OSC.1 61.6,34.92 62.61,33.91 66.42,33.91 67.31,33.02 ARDUINO-ATMEGA328.8
N$6
  Top 0.254: OSC.3 63.11,37.22 62.23,38.1 58.81,38.1 C4.2
  Top 0.406: OSC.3 64.25,37.22 67.69,33.78 68.32,33.78 ARDUINO-ATMEGA328.7
N$8
  Top 0.254: STATUS_LED.A 82.03,32.71 STATUS_RES.2
N$9
  Top 0.254: FTDI.RXI 82.55,46.99 81.03,48.51 79.5,48.51 78.74,47.75 78.74,44.2 77.72,43.18 68.83,43.18 67.56,41.91 67.56,40.39 67.82,40.13 68.83,40.13 69.09,40.39 69.09,40.89 69.6,41.4 70.36,41.4 70.64,41.12 ARDUINO-ATMEGA328.31
N$10
  Top 0.254: FTDI.TXO 85.09,46.99 83.57,48.51 81.79,48.51 81.28,49.02 79.25,49.02 78.23,48.01 78.23,44.45 77.47,43.69 68.58,43.69 67.06,42.16 67.06,39.88 67.31,39.62 68.83,39.62 69.85,38.61 69.85,37.85 70.36,37.34 71.37,37.34 71.63,37.59 71.63,39.92 ARDUINO-ATMEGA328.30 71.37,40.04
N$11  (via drill 0.51)
  Top 0.254: CS_PULL_UP.2 83.06,41.91 | 83.06,41.91 92.71,41.91 94.49,40.13 96.02,40.13 MICRO-SD.2 | ARDUINO-ATMEGA328.14 73.84,32.7 v74.17,33.02 | v83.82,41.15 83.06,41.91
  Bottom 0.254: v74.17,33.02 74.42,33.27 75.95,33.27 76.96,34.29 76.96,41.4 77.47,41.91 83.06,41.91 v83.82,41.15
N$12
  Top 0.254: NTR2.P$7 53.85,1.02 53.34,0.51 43.18,0.51 42.42,1.27 42.42,3.05 41.91,3.56 40.39,3.56 39.62,4.32 37.85,4.32 36.83,3.3 36.83,2.54 36.58,2.29 33.27,2.29 32.77,1.78 32.77,1.02 32.26,0.51 30.23,0.51 29.21,1.52 NTR2_RES2.2 NTR2_RES4.1 NTR2_RES3.2
N$13
  Top 0.254: GPS_RES1.1 58.67,28.19 59.69,27.18 63.5,27.18 64.52,26.16 64.52,24.38 65.02,23.88 65.71,23.88 GPS.3
N$14
  Top 0.254: GPS_RES3.2 63.25,29.21 65.53,26.92 66.8,26.92 67.82,25.91 67.82,20.57 67.31,20.07 64.77,20.07 64.26,20.57 64.26,22.1 64.77,22.61 65.71,22.61 GPS.5
N$15
  Top 0.254: R1.2 12.01,33.45 14.48,30.99 17.78,30.99 18.03,31.24 18.03,32.58 OPAMP.3
N$16
  Top 0.254: NTR2_RES1.2 31.11,1.59 NTR2_RES2.1
N$20  (via drill 0.51)
  Top 0.254: UP_CAP1.2 UP_RES4.1 | UP_RES4.1 24.32,34.36 | v19.3,40.39 19.3,38.03 OPAMP.5 | v24.38,32.51 24.38,33.72 UP_RES4.1
  Bottom 0.254: v19.3,40.39 19.56,40.13 19.56,35.56 22.61,32.51 v24.38,32.51
N$22  (via drill 0.51)
  Top 0.254: R2.3 13.39,37.16 14.48,36.07 | 14.48,36.07 16.26,36.07 | OPAMP.7 16.89,36.7 16.26,36.07 | 16.26,36.07 16.51,35.81 20.32,35.81 20.83,36.32 20.83,39.12 21.34,39.62 UP_RES1.2 | UP_CAP3.1 28.08,30.36 v27.18,29.46 | v14.48,35.05 14.48,36.07
  Bottom 0.254: v27.18,29.46 26.67,29.46 25.65,30.48 18.29,30.48 18.03,30.73 18.03,32.77 16.51,34.29 15.24,34.29 v14.48,35.05
N$23  (via drill 0.51)
  Top 0.254: OPAMP.6 18.29,38.03 18.29,39.37 17.6,40.06 R2.2 9.65,38.78 R2.1 8.64,36.15 v8.64,35.56 | UP_CAP3.2 UP_RES2.1 24.32,29.91 v23.88,29.46
  Bottom 0.254: v23.88,29.46 18.03,29.46 17.02,30.48 17.02,32.26 15.75,33.53 9.91,33.53 8.64,34.8 v8.64,35.56
NTR2_AF
  Top 0.254: NTR2.P$4 46.23,5.08 44.2,7.11 27.43,7.11 26.67,7.87 26.67,23.88 29.21,26.42 29.21,32.9 28.33,33.78 UP_CAP1.1
NTR2_EN  (via drill 0.51)
  Top 0.254: v73.91,29.97 73.41,29.97 72.9,30.48 71.63,30.48 71.37,30.73 71.37,31.45 ARDUINO-ATMEGA328.11 | v57.66,6.35 57.66,5.08 56.64,4.06 52.07,4.06 51.31,3.3 NTR2.P$6
  Bottom 0.254: v73.91,29.97 73.41,29.46 60.45,29.46 58.17,27.18 58.17,6.86 v57.66,6.35
NTR2_RSSI  (via drill 0.51)
  Top 0.254: ARDUINO-ATMEGA328.24 76.21,38.61 75.69,38.1 74.93,38.1 73.15,36.32 v72.64,36.32
  Bottom 0.254: NTR2.P$1 38.61,5.59 40.13,7.11 56.64,7.11 57.66,8.13 57.66,27.43 60.2,29.97 68.07,29.97 72.64,34.54 v72.64,36.32
RANDOM
  Top 0.254: UP_RES1.1 24.38,39.12 24.38,38.61 24.89,38.1 | OPAMP.2 16.89,34.67 17.53,35.31 20.57,35.31 21.34,36.07 21.34,37.59 21.84,38.1 24.89,38.1 | UP_CAP4.1 26.16,36.95 26.16,37.59 25.65,38.1 24.89,38.1
RF_IN
  Top 1.27: 16.26,4.95 SMA_CONN.1
  Top 2.184: NTR2.P$9 5.59,5.59 arc-90 10.16,10.16 11.05,10.16 arc-90 16.26,4.95
SCK  (via drill 0.51)
  Top 0.254: ARDUINO-ATMEGA328.17 77.44,32.51 STATUS_RES.1 80.33,32.58 81.28,33.53 v81.28,34.04 | ICSP.3 97.03,21.59 98.3,22.86 98.3,25.15 97.79,25.65 97.79,27.18 98.55,27.94 98.55,29.97 97.79,30.73 97.79,36.32 97.28,36.83 96.08,36.83 MICRO-SD.5 83.03,36.86 v81.79,38.1
  Bottom 0.254: v81.28,34.04 81.28,36.32 81.79,36.83 v81.79,38.1
TEMPERATURE  (via drill 0.51)
  Top 0.254: v29.46,37.34 29.46,36.58 | 29.46,36.58 29.72,36.32 30.58,36.32 INTERNAL_TEMP.4 | v70.61,38.61 69.85,39.37 ARDUINO-ATMEGA328.32 | TEMPADD.2 8.89,47.5 9.65,48.26 17.27,48.26 18.03,47.5 TEMPEXT.2 | 29.46,36.58 29.46,36.07 28.96,35.56 24.89,35.56 24.38,36.07 24.38,36.76 1WIRE.1 24.38,36.51
  Bottom 0.254: v70.61,38.61 69.34,38.61 69.09,38.35 67.31,38.35 66.55,37.59 29.72,37.59 v29.46,37.34 29.46,42.42 28.7,43.18 18.8,43.18 18.03,43.94 TEMPEXT.2
TX_0  (via drill 0.51)
  Top 0.254: v68.33,31.5 69.82,31.5 ARDUINO-ATMEGA328.9 | v31.5,5.84 NTR2_RES1.1
  Bottom 0.254: v31.5,5.84 33.27,7.62 56.39,7.62 57.15,8.38 57.15,27.69 59.94,30.48 67.82,30.48 68.33,30.99 v68.33,31.5
TX_1  (via drill 0.51)
  Top 0.254: ARDUINO-ATMEGA328.10 70.64,30.51 69.85,29.72 69.85,29.46 69.6,29.21 66.55,29.21 66.04,29.72 66.04,30.73 v66.8,31.5 | NTR2_RES3.1 v24.64,5.84 24.64,23.88 23.62,24.89 2.79,24.89 1.27,26.42 1.27,36.58 2.54,37.85 EXT_TX.3
  Bottom 0.254: v66.8,31.5 65.79,31.5 65.28,30.99 59.69,30.99 56.64,27.94 56.64,8.64 56.13,8.13 26.92,8.13 v24.64,5.84
UPLINK  (via drill 0.51)
  Top 0.254: ARDUINO-ATMEGA328.12 72.24,33.67 v70.87,35.05 | v14.22,32.51 15.43,32.51 OPAMP.1
  Bottom 0.254: v14.22,32.51 14.73,32 14.73,27.94 16,26.67 34.54,26.67 35.31,27.43 35.31,36.32 36.07,37.08 67.06,37.08 69.09,35.05 v70.87,35.05
VBATT
  Top 0.254: NTR2_DCPLG2.2 NTR2_DCPLG1.2 35.95,3.19 37.59,4.83 39.88,4.83 40.64,4.06 42.16,4.06 42.93,3.3 42.93,2.79 NTR2.P$3 | 89.04,10.21 BATT.2 89.29,10.36 C2.1
  Top 0.305: VREG.5 97.41,12.32 98.3,13.21 98.3,15.24 97.28,16.26 96.71,16.26 VREG.8
  Top 0.61: VREG.5 96.52,12.26 96.52,11.18 95.25,9.91 P.1 94.23,10.16 BATT.2
  Bottom 0.61: NTR2.P$3 43.69,4.32 44.45,5.08 88.9,5.08 92.71,8.89 95,8.89 P.1
VCC  (via drill 0.51)
  Top 0.254: C8.2 C6.2 C7.2 64.63,38.98 | 69.85,35.56 69.2,36.21 ARDUINO-ATMEGA328.4 68.24,36.32 67.56,36.32 67.31,36.58 66.04,36.58 65.28,37.34 65.28,38.35 64.65,38.98 64.63,38.98 | 69.85,35.56 69.85,35.05 69.34,34.54 | 69.34,34.54 68.42,34.54 ARDUINO-ATMEGA328.6 | VREG.1 VREG.2 90.55,14.86 | ICSP.2 91.44,19.05 90.03,20.46 C3.1 | VREG.1 91.38,16.57 90.17,17.78 88.9,17.78 88.39,18.29 88.39,20.07 88.78,20.46 C3.1 | GPS.7 65.79,21.34 66.55,21.34 67.31,22.1 67.31,25.65 66.55,26.42 65.28,26.42 63.75,27.94 62.99,27.94 61.15,29.78 GPS_RES2.1 59.06,31.68 GPS_RES1.2 58.62,31.63 GPS_DCPLG.1 56.64,32.26 56.13,32.77 55.12,32.77 54.1,33.78 54.1,38.35 55.12,39.37 55.88,39.37 56.39,39.88 56.64,39.88 56.9,40.13 56.9,41.4 59.69,44.2 ANLG_HDR1.1 | VREG.1 91.25,16.26 87.38,16.26 86.61,15.49 86.61,13.97 86.11,13.46 86.11,7.11 86.49,6.73 88.65,6.73 89.09,6.29 RES_PWR.2 | C3.1 C1.1 89.78,22.61 86.87,22.61 86.11,23.37 86.11,26.42 85.34,27.18 85.34,27.69 83.31,29.72 79.25,29.72 78.99,29.97 75.18,29.97 74.42,29.21 73.41,29.21 72.64,29.97 70.87,29.97 70.36,29.46 70.36,29.21 69.85,28.7 66.29,28.7 65.53,29.46 65.53,31.75 66.04,32.26 69.09,32.26 69.85,33.02 69.85,34.04 69.34,34.54 | MICRO-SD.4 95.94,37.85 83.57,37.85 82.18,39.23 SD_DCPLG.2 82.18,39.74 81.28,40.64 80.77,40.64 80.26,41.15 80.26,41.84 CS_PULL_UP.1 80.26,41.98 80.26,42.93 80.52,43.18 83.82,43.18 83.95,43.31 v83.95,44.7 | ARDUINO-ATMEGA328.20 75.04,35.41 74.42,34.8 74.42,34.54 | 74.42,34.54 74.42,34.29 74.93,33.78 74.96,33.81 ARDUINO-ATMEGA328.18 | 74.42,34.54 73.41,35.56 71.63,35.56 71.12,36.07 70.36,36.07 69.85,35.56
  Top 0.254: 64.63,38.98 65.28,39.62 v65.28,40.64 | EXT_TX.1 3.81,31.24 4.57,30.48 9.57,30.48 R1.1 9.4,30.8 9.4,34.54 10.92,36.07 10.92,38.1 11.43,38.61 13.21,38.61 13.91,37.91 OPAMP.8 15.62,39.24 16,39.62 17.02,39.62 17.53,39.12 17.53,36.58 17.78,36.32 20.07,36.32 20.32,36.58 20.32,40.13 21.08,40.89 25.91,40.89 26.28,41.26 | I2C-2.1 24.64,43.18 26.28,41.54 26.28,41.4 26.42,41.4 | I2C_RES2.1 31.88,38.04 INTERNAL_TEMP.3 31.75,36.22 31.75,34.8 31.24,34.29 29.72,34.29 28.96,35.05 23.88,35.05 22.42,36.51 1WIRE.2 | I2C_RES2.1 I2C_RES1.1 | I2C_RES2.1 30.67,38.93 28.19,41.4 26.42,41.4 | TEMP_DCPLG.2 26.28,41.26 | 26.28,41.26 26.42,41.4
  Bottom 0.254: 60.45,48.26 69.34,48.26 71.37,46.23 DGTL_HDR.1 71.37,46.99 72.14,47.75 77.47,47.75 78.23,46.99 78.23,43.94 78.99,43.18 83.57,43.18 83.82,43.43 83.82,44.58 v83.95,44.7 | 60.45,48.26 48.77,48.26 | 48.77,48.26 37.34,48.26 | 37.34,48.26 25.4,48.26 | 25.4,48.26 21.34,48.26 | 21.34,48.26 12.19,48.26 11.43,47.5 TEMPADD.3 | TEMPEXT.3 20.57,47.5 21.34,48.26 | I2C-2.1 24.64,47.5 25.4,48.26 | I2C-1.1 36.32,47.24 37.34,48.26 | ANLG_HDR2.1 48.01,47.5 48.77,48.26 | 60.45,48.26 59.69,47.5 ANLG_HDR1.1 59.69,44.2 60.45,43.43 64.26,43.43 65.28,42.42 v65.28,40.64

### Text on the board
tPlace: . | . | . | . | . | . | . | . | FTDI | TEMP | TEMP | I2C | I2C | ANLG-2 | ANLG-1 | DGTL | STATUS | . | OPAMP | TEMP | MICRO SD | ORDER#: | AVR | 41940 | APEXIII | EXT-TX | CORE | NTR2 | GPS | RST | . | ICSP | VREG | V+ | BATT | NTR2 | GND | POWER | PRIYESH | PATEL
bPlace: TEMP | TEMP | I2C | I2C | ANLG-2 | ANLG-1 | DGTL | DTR | RXI | TXO | VCC | CTS | GND | - | D | + | - | D | + | + | C | D | - | + | C | D | - | + | - | 2 | 3 | + | - | 6 | 7 | + | - | 9 | FTDI | EXT-TX | T | - | + | ICSP | RST | GND | SCK | MOSI | MISO | VCC | + | - | BATT | PATEL | PRIYESH